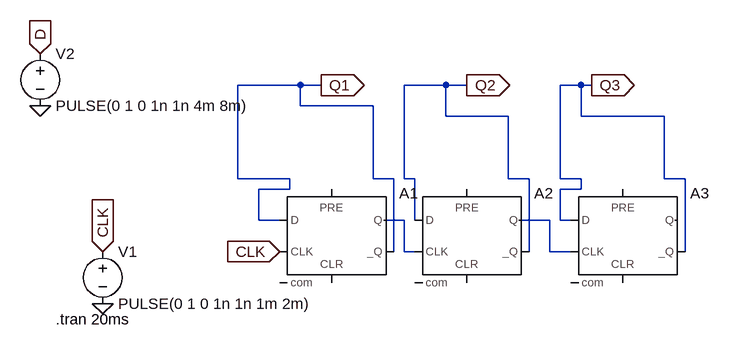
[diagram p0: schematic DFlop.asc]
DFlop.asc, the LTspice schematic file:
Version 4
SHEET 1 936 680
WIRE 336 -48 240 -48
WIRE 368 -48 336 -48
WIRE 560 -48 496 -48
WIRE 592 -48 560 -48
WIRE 768 -48 736 -48
WIRE 784 -48 768 -48
WIRE 336 -16 336 -48
WIRE 448 -16 336 -16
WIRE 560 0 560 -48
WIRE 656 0 560 0
WIRE 768 0 768 -48
WIRE 896 0 768 0
WIRE 240 96 240 -48
WIRE 320 96 240 96
WIRE 448 96 448 -16
WIRE 480 96 448 96
WIRE 496 96 496 -48
WIRE 512 96 496 96
WIRE 656 96 656 0
WIRE 688 96 656 96
WIRE 736 96 736 -48
WIRE 768 96 736 96
WIRE 896 96 896 0
WIRE 928 96 896 96
WIRE 320 112 320 96
WIRE 320 112 272 112
WIRE 768 112 768 96
WIRE 768 112 736 112
WIRE 272 160 272 112
WIRE 304 160 272 160
WIRE 496 160 464 160
WIRE 512 160 512 96
WIRE 720 160 672 160
WIRE 736 160 736 112
WIRE 752 160 736 160
WIRE 480 208 480 96
WIRE 496 208 496 160
WIRE 512 208 496 208
WIRE 688 208 688 96
WIRE 720 208 720 160
WIRE 752 208 720 208
WIRE 928 208 928 96
FLAG 32 208 CLK
IOPIN 32 208 In
FLAG 304 208 CLK
IOPIN 304 208 In
FLAG 32 288 0
FLAG 368 -48 Q1
IOPIN 368 -48 Out
FLAG 592 -48 Q2
IOPIN 592 -48 Out
FLAG 784 -48 Q3
IOPIN 784 -48 Out
FLAG -64 -16 0
FLAG -64 -96 D
IOPIN -64 -96 In
SYMBOL voltage 32 192 R0
WINDOW 123 0 0 Left 0
WINDOW 39 0 0 Left 0
SYMATTR InstName V1
SYMATTR Value PULSE(0 1 0 1n 1n 1m 2m)
SYMBOL voltage -64 -112 R0
WINDOW 123 0 0 Left 0
WINDOW 39 0 0 Left 0
SYMATTR InstName V2
SYMATTR Value PULSE(0 1 0 1n 1n 4m 8m)
SYMBOL Digital\\dflop 384 112 R0
SYMATTR InstName A1
SYMBOL Digital\\dflop 592 112 R0
SYMATTR InstName A2
SYMBOL Digital\\dflop 832 112 R0
SYMATTR InstName A3
TEXT -40 312 Left 2 !.tran 20ms

The netlist it stands for:
* DFlop.asc
V1 CLK 0 PULSE(0 1 0 1n 1n 1m 2m)
V2 D 0 PULSE(0 1 0 1n 1n 4m 8m)
A1 Q1 0 CLK 0 0 Q1 N001 0 DFLOP
A2 Q2 0 N001 0 0 Q2 N002 0 DFLOP
A3 Q3 0 N002 0 0 Q3 0 0 DFLOP
.tran 20ms
.backanno
.end